# Altium project DM1092_R0M0E0.PrjPcb (part 1 of 5)
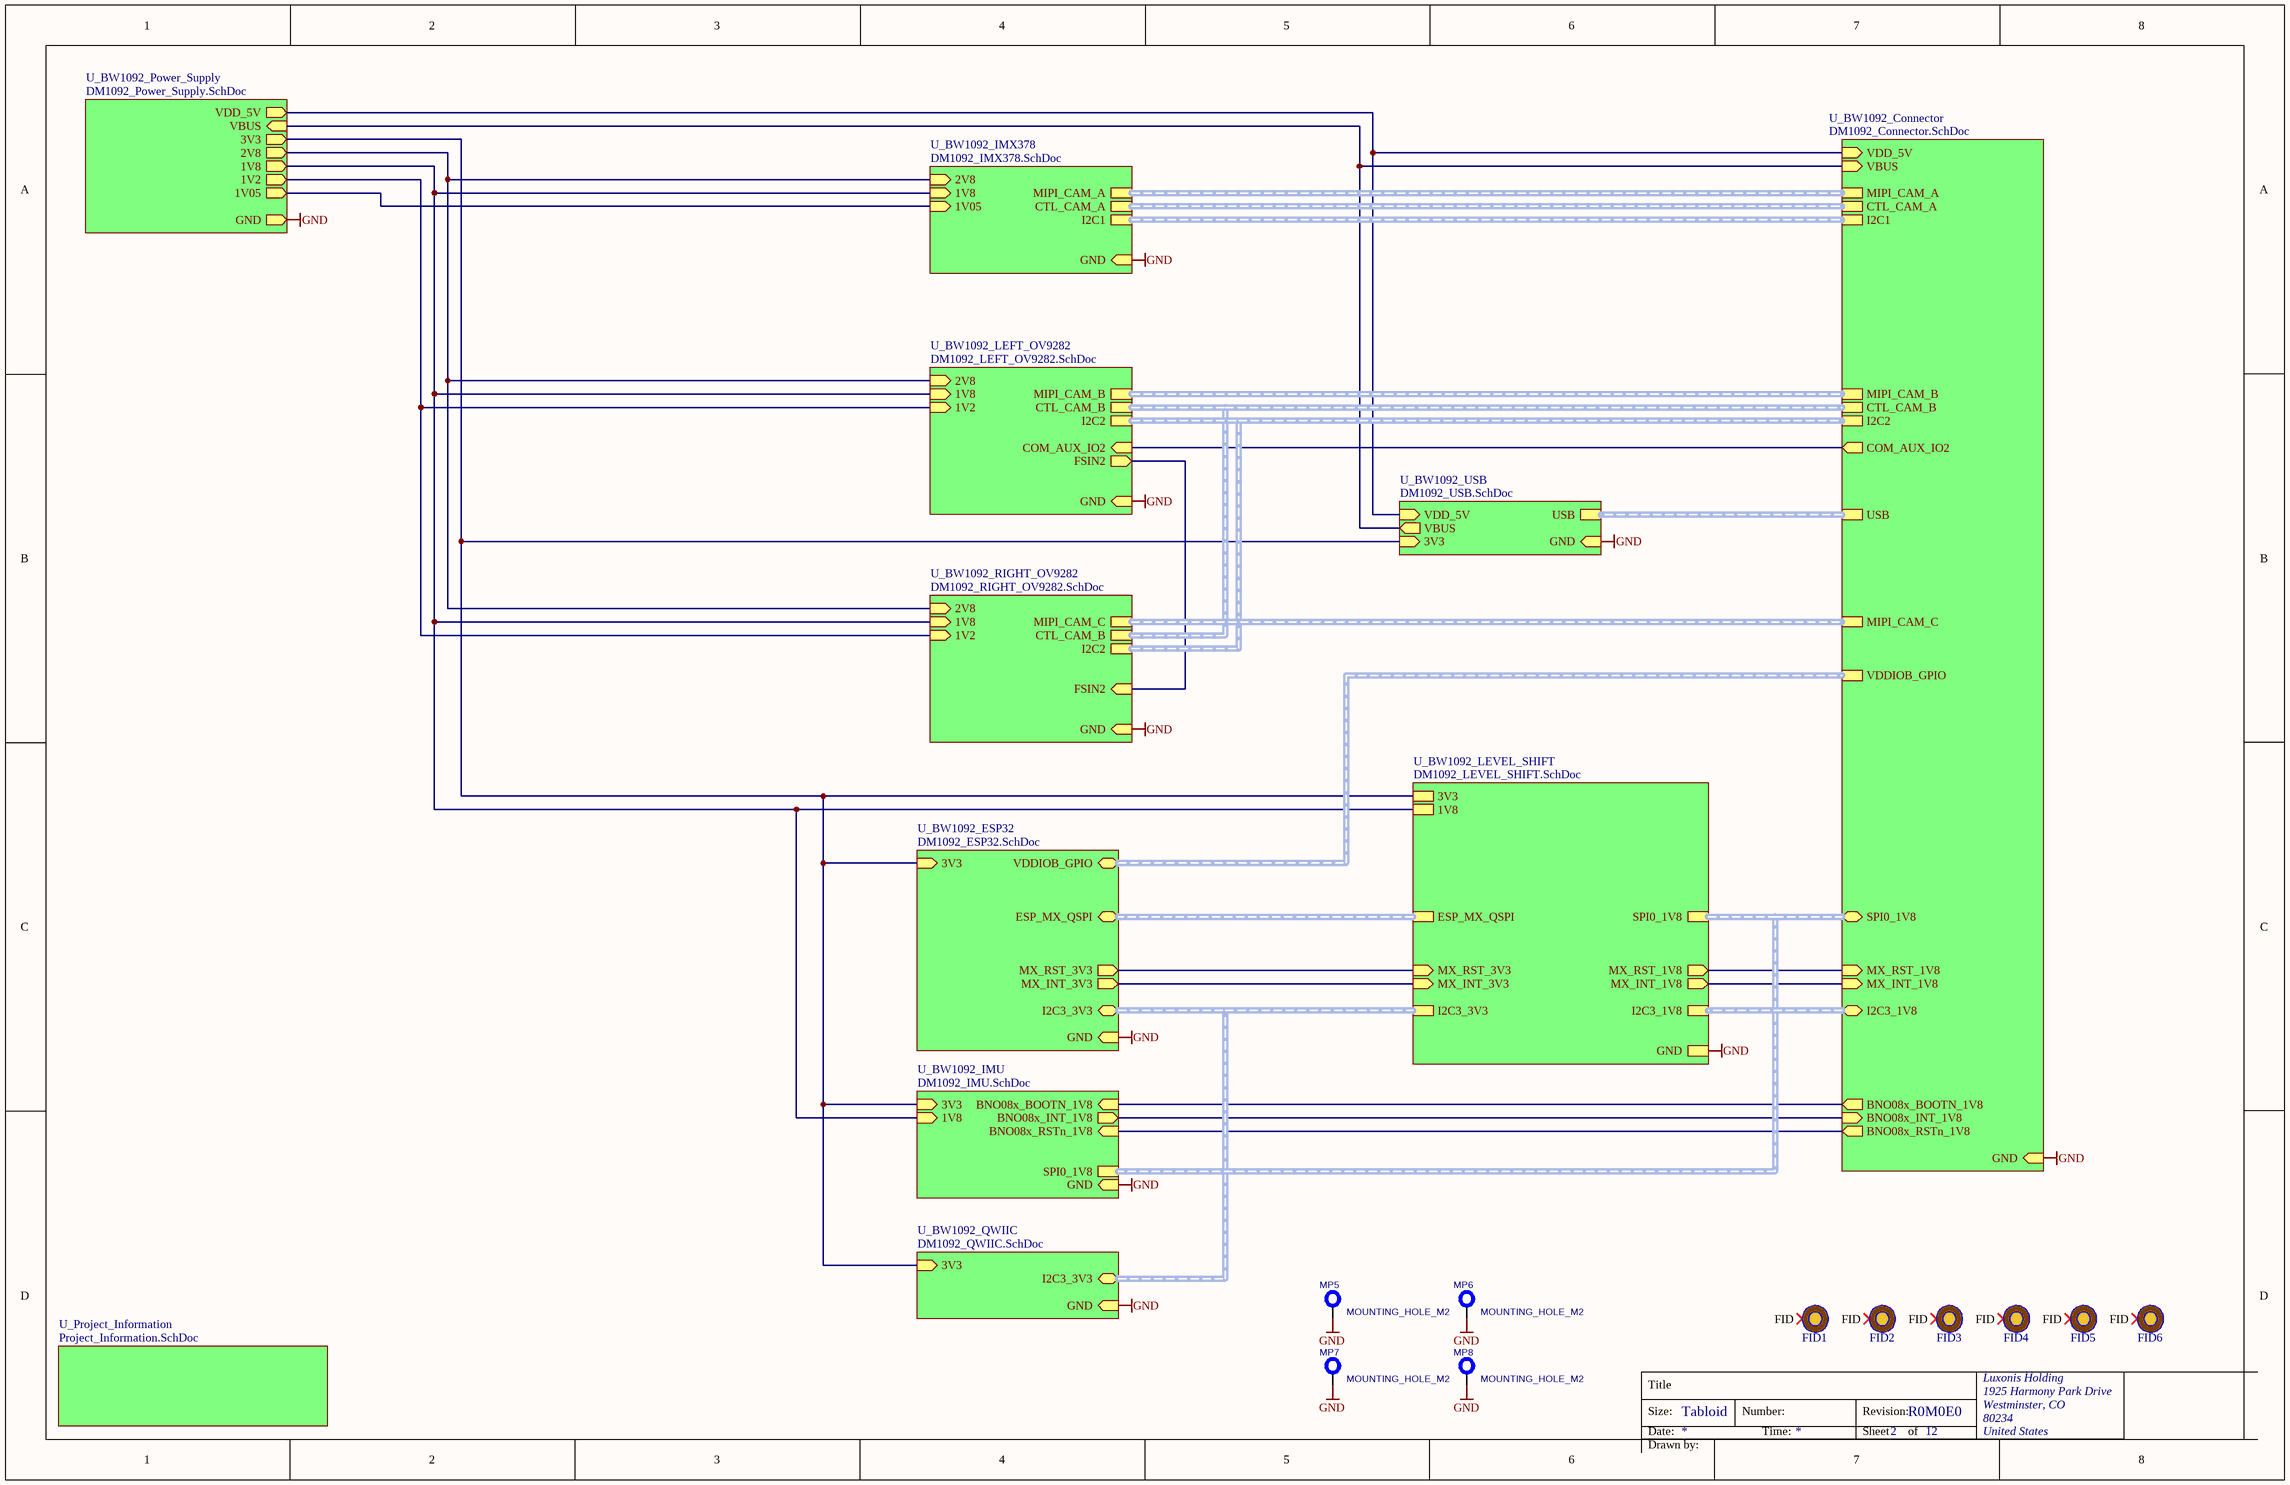
[diagram p0: DM1092_TopLevel.SchDoc]
document_number: DXXXX; drawn_by: David Malovrh; project_title: DM1092; revision: R0M0E0
9 sheets, 149 parts. Net scope: strictly hierarchical (ports join the sheet entries above them; power ports are local).
Board file: DM1092.PcbDoc
Sheets:
  DM1092_TopLevel.SchDoc
    U_BW1092_Power_Supply = DM1092_Power_Supply.SchDoc
    U_BW1092_Connector = DM1092_Connector.SchDoc
    U_BW1092_IMX378 = DM1092_IMX378.SchDoc
    U_Project_Information = Project_Information.SchDoc
    U_BW1092_ESP32 = DM1092_ESP32.SchDoc
    U_BW1092_IMU = DM1092_IMU.SchDoc
    U_BW1092_QWIIC = DM1092_QWIIC.SchDoc
    U_BW1092_LEVEL_SHIFT = DM1092_LEVEL_SHIFT.SchDoc

## Sheet DM1092_TopLevel.SchDoc: =project_title
size Tabloid; CompanyName: Luxonis Holding; DrawnBy: David Malovrh; Organization: Luxonis Holding; Address1: 1925 Harmony Park Drive; Address2: Westminster, CO; Address3: 80234; Address4: United States; DocumentNumber: DXXXX; Revision: R0M0E0; SheetNumber: 2; SheetTotal: 12

### Parts
FID1  FIDUCIAL_ROUND_1MM  [FIDUCIAL_ROUND_1MM]  (value not drawn)  (no BOM)
FID2  FIDUCIAL_ROUND_1MM  [FIDUCIAL_ROUND_1MM]  (value not drawn)  (no BOM)
FID3  FIDUCIAL_ROUND_1MM  [FIDUCIAL_ROUND_1MM]  (value not drawn)  (no BOM)
FID4  FIDUCIAL_ROUND_1MM  [FIDUCIAL_ROUND_1MM]  (value not drawn)  (no BOM)
FID5  FIDUCIAL_ROUND_1MM  [FIDUCIAL_ROUND_1MM]  (value not drawn)  (no BOM)
FID6  FIDUCIAL_ROUND_1MM  [FIDUCIAL_ROUND_1MM]  (value not drawn)  (no BOM)
MP5  MOUNTING_HOLE_M2  [MOUNTING_HOLE_M2]  (no BOM)
MP6  MOUNTING_HOLE_M2  [MOUNTING_HOLE_M2]  (no BOM)
MP7  MOUNTING_HOLE_M2  [MOUNTING_HOLE_M2]  (no BOM)
MP8  MOUNTING_HOLE_M2  [MOUNTING_HOLE_M2]  (no BOM)

### Sub-sheets
U_BW1092_Connector = DM1092_Connector.SchDoc: MIPI_CAM_B (harness MIPI_CAM_B), MIPI_CAM_A (harness MIPI_CAM_A), MIPI_CAM_C (harness MIPI_CAM_C), I2C2 (harness I2C2), I2C1 (harness I2C1), CTL_CAM_A (harness CTL_CAM_A), CTL_CAM_B (harness CTL_CAM_B), VDD_5V (in), GND (in), VBUS (in), USB (harness USB), COM_AUX_IO2 (out), BNO08x_INT_1V8 (in), BNO08x_RSTn_1V8 (out), BNO08x_BOOTN_1V8 (out), SPI0_1V8 (bidir, harness SP0_1V8), I2C3_1V8 (bidir, harness I2C3_1V8), MX_INT_1V8 (in), MX_RST_1V8 (in), VDDIOB_GPIO (harness VDDIOB_GPIO)
U_BW1092_ESP32 = DM1092_ESP32.SchDoc: GND (in), 3V3 (in), MX_RST_3V3 (out), MX_INT_3V3 (out), I2C3_3V3 (bidir, harness I2C3_3V3), VDDIOB_GPIO (bidir, harness VDDIOB_GPIO), ESP_MX_QSPI (bidir, harness ESP_MX_QSPI_3V3)
U_BW1092_IMU = DM1092_IMU.SchDoc: BNO08x_BOOTN_1V8 (in), GND (in), 3V3 (in), BNO08x_INT_1V8 (out), BNO08x_RSTn_1V8 (in), SPI0_1V8, 1V8 (in)
U_BW1092_IMX378 = DM1092_IMX378.SchDoc: 2V8 (in), 1V05 (in), I2C1 (harness I2C1), MIPI_CAM_A (harness MIPI_CAM_A), CTL_CAM_A (harness CTL_CAM_A), GND (in), 1V8 (in)
U_BW1092_LEFT_OV9282 = DM1092_LEFT_OV9282.SchDoc (file not in this document): I2C2 (harness I2C2), CTL_CAM_B (harness CTL_CAM_B), MIPI_CAM_B (harness MIPI_CAM_B), 1V2 (in), 2V8 (in), GND (in), 1V8 (in), FSIN2 (out), COM_AUX_IO2 (in)
U_BW1092_LEVEL_SHIFT = DM1092_LEVEL_SHIFT.SchDoc: GND, 3V3, 1V8, I2C3_3V3 (harness I2C3_3V3), I2C3_1V8 (harness I2C3_1V8), MX_INT_3V3 (in), MX_INT_1V8 (out), MX_RST_1V8 (out), MX_RST_3V3 (in), SPI0_1V8 (harness SP0_1V8), ESP_MX_QSPI (harness ESP_MX_QSPI_3V3)
U_BW1092_Power_Supply = DM1092_Power_Supply.SchDoc: 1V2 (out), 2V8 (out), GND (out), 1V8 (out), VDD_5V (out), VBUS (in), 3V3 (out), 1V05 (out)
U_BW1092_QWIIC = DM1092_QWIIC.SchDoc: GND (in), 3V3 (in), I2C3_3V3 (bidir, harness I2C3_3V3)
U_BW1092_RIGHT_OV9282 = DM1092_RIGHT_OV9282.SchDoc (file not in this document): MIPI_CAM_C (harness MIPI_CAM_C), I2C2 (harness I2C2), 1V2 (in), 2V8 (in), GND (in), 1V8 (in), FSIN2 (in), CTL_CAM_B (harness CTL_CAM_B)
U_BW1092_USB = DM1092_USB.SchDoc (file not in this document): USB (harness USB), VBUS (out), GND (in), 3V3 (in), VDD_5V (in)
U_Project_Information = Project_Information.SchDoc: no entries

### Nets
1V2: sheet U_BW1092_Power_Supply/1V2, sheet U_BW1092_RIGHT_OV9282/1V2, sheet U_BW1092_LEFT_OV9282/1V2
1V05: sheet U_BW1092_Power_Supply/1V05, sheet U_BW1092_IMX378/1V05
1V8: sheet U_BW1092_Power_Supply/1V8, sheet U_BW1092_IMX378/1V8, sheet U_BW1092_RIGHT_OV9282/1V8, sheet U_BW1092_LEFT_OV9282/1V8, sheet U_BW1092_IMU/1V8, sheet U_BW1092_LEVEL_SHIFT/1V8
2V8: sheet U_BW1092_Power_Supply/2V8, sheet U_BW1092_IMX378/2V8, sheet U_BW1092_RIGHT_OV9282/2V8, sheet U_BW1092_LEFT_OV9282/2V8
3V3: sheet U_BW1092_Power_Supply/3V3, sheet U_BW1092_USB/3V3, sheet U_BW1092_ESP32/3V3, sheet U_BW1092_IMU/3V3, sheet U_BW1092_QWIIC/3V3, sheet U_BW1092_LEVEL_SHIFT/3V3
GND: MP5.1 MP6.1 MP7.1 MP8.1 ; sheet U_BW1092_Power_Supply/GND, sheet U_BW1092_Connector/GND, sheet U_BW1092_IMX378/GND, sheet U_BW1092_RIGHT_OV9282/GND, sheet U_BW1092_LEFT_OV9282/GND, sheet U_BW1092_USB/GND, sheet U_BW1092_ESP32/GND, sheet U_BW1092_IMU/GND, sheet U_BW1092_QWIIC/GND, sheet U_BW1092_LEVEL_SHIFT/GND
VBUS: sheet U_BW1092_Power_Supply/VBUS, sheet U_BW1092_Connector/VBUS, sheet U_BW1092_USB/VBUS
VDD_5V: sheet U_BW1092_Power_Supply/VDD_5V, sheet U_BW1092_Connector/VDD_5V, sheet U_BW1092_USB/VDD_5V
BNO08x_INT_1V8: sheet U_BW1092_Connector/BNO08x_INT_1V8, sheet U_BW1092_IMU/BNO08x_INT_1V8
BNO08x_RSTn_1V8: sheet U_BW1092_Connector/BNO08x_RSTn_1V8, sheet U_BW1092_IMU/BNO08x_RSTn_1V8
COM_AUX_IO2: sheet U_BW1092_Connector/COM_AUX_IO2, sheet U_BW1092_LEFT_OV9282/COM_AUX_IO2
MX_INT_1V8: sheet U_BW1092_Connector/MX_INT_1V8, sheet U_BW1092_LEVEL_SHIFT/MX_INT_1V8
MX_INT_3V3: sheet U_BW1092_ESP32/MX_INT_3V3, sheet U_BW1092_LEVEL_SHIFT/MX_INT_3V3
MX_RST_1V8: sheet U_BW1092_Connector/MX_RST_1V8, sheet U_BW1092_LEVEL_SHIFT/MX_RST_1V8
MX_RST_3V3: sheet U_BW1092_ESP32/MX_RST_3V3, sheet U_BW1092_LEVEL_SHIFT/MX_RST_3V3
NetJ1_4: sheet U_BW1092_Connector/BNO08x_BOOTN_1V8, sheet U_BW1092_IMU/BNO08x_BOOTN_1V8
(unnamed): sheet U_BW1092_RIGHT_OV9282/FSIN2, sheet U_BW1092_LEFT_OV9282/FSIN2

Not connected (* = marked no-connect by the designer): FID1 FID*; FID2 FID*; FID3 FID*; FID4 FID*; FID5 FID*; FID6 FID*

### Buses and harness runs
harness sheet U_BW1092_Connector/CTL_CAM_A = sheet U_BW1092_IMX378/CTL_CAM_A
harness sheet U_BW1092_Connector/CTL_CAM_B = sheet U_BW1092_LEFT_OV9282/CTL_CAM_B = sheet U_BW1092_RIGHT_OV9282/CTL_CAM_B
harness sheet U_BW1092_Connector/I2C1 = sheet U_BW1092_IMX378/I2C1
harness sheet U_BW1092_Connector/I2C2 = sheet U_BW1092_LEFT_OV9282/I2C2 = sheet U_BW1092_RIGHT_OV9282/I2C2
harness sheet U_BW1092_Connector/I2C3_1V8 = sheet U_BW1092_LEVEL_SHIFT/I2C3_1V8
harness sheet U_BW1092_Connector/MIPI_CAM_A = sheet U_BW1092_IMX378/MIPI_CAM_A
harness sheet U_BW1092_Connector/MIPI_CAM_B = sheet U_BW1092_LEFT_OV9282/MIPI_CAM_B
harness sheet U_BW1092_Connector/MIPI_CAM_C = sheet U_BW1092_RIGHT_OV9282/MIPI_CAM_C
harness sheet U_BW1092_Connector/SPI0_1V8 = sheet U_BW1092_IMU/SPI0_1V8 = sheet U_BW1092_LEVEL_SHIFT/SPI0_1V8
harness sheet U_BW1092_Connector/USB = sheet U_BW1092_USB/USB
harness sheet U_BW1092_Connector/VDDIOB_GPIO = sheet U_BW1092_ESP32/VDDIOB_GPIO
harness sheet U_BW1092_ESP32/ESP_MX_QSPI = sheet U_BW1092_LEVEL_SHIFT/ESP_MX_QSPI
harness sheet U_BW1092_ESP32/I2C3_3V3 = sheet U_BW1092_LEVEL_SHIFT/I2C3_3V3 = sheet U_BW1092_QWIIC/I2C3_3V3

### Notes on the sheet
- Title
- Size:
- Date:
- Tabloid
- Number:
- Time:
- Revision:
- Sheet
- of
- Drawn by:

### Library data of the parts
FID1-FID6 = FIDUCIAL: Fiducial with various available footprints
MP5-MP8 = MP_Mounting-Holes: =CurrentFootprint; B - Value: Not a Part; A - Level: 0